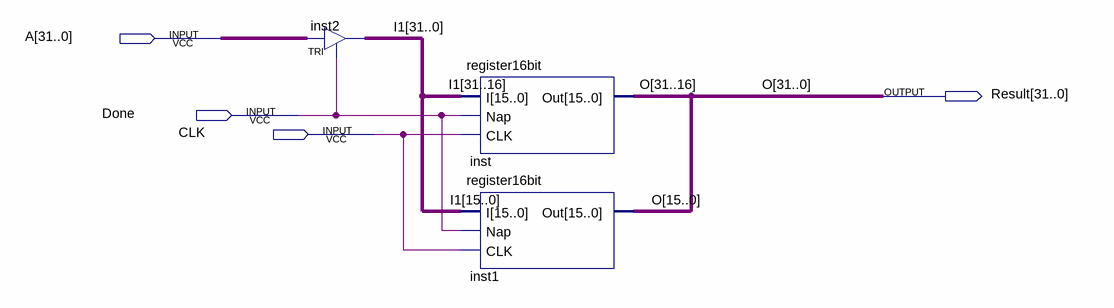
[diagram p0: schematic sheet]
// Quartus schematic Register32bit.bdf as structural Verilog: 3 symbols, 4 pins
module Register32bit (
  input  [31:0] A,
  input  Done,
  input  CLK,
  output [31:0] Result
);

  wire [31:0] I1;

  TRI inst2[31:0] (.IN(A), .OE(Done), .OUT(I1));
  register16bit inst (.I(I1[31:16]), .Nap(Done), .CLK(CLK), .Out(Result[31:16]));
  register16bit inst1 (.I(I1[15:0]), .Nap(Done), .CLK(CLK), .Out(Result[15:0]));

  // Other names for the same wires on the sheet: O[31:0] = Result
endmodule
